# EasyEDA schematic SCH_WEARBLE HEALTH MONITER_2024-07-04.json
TITLE: Sheet_1; REV: 1.0; Date: 2024-07-02; Sheet: 1/1; Company: Your Company
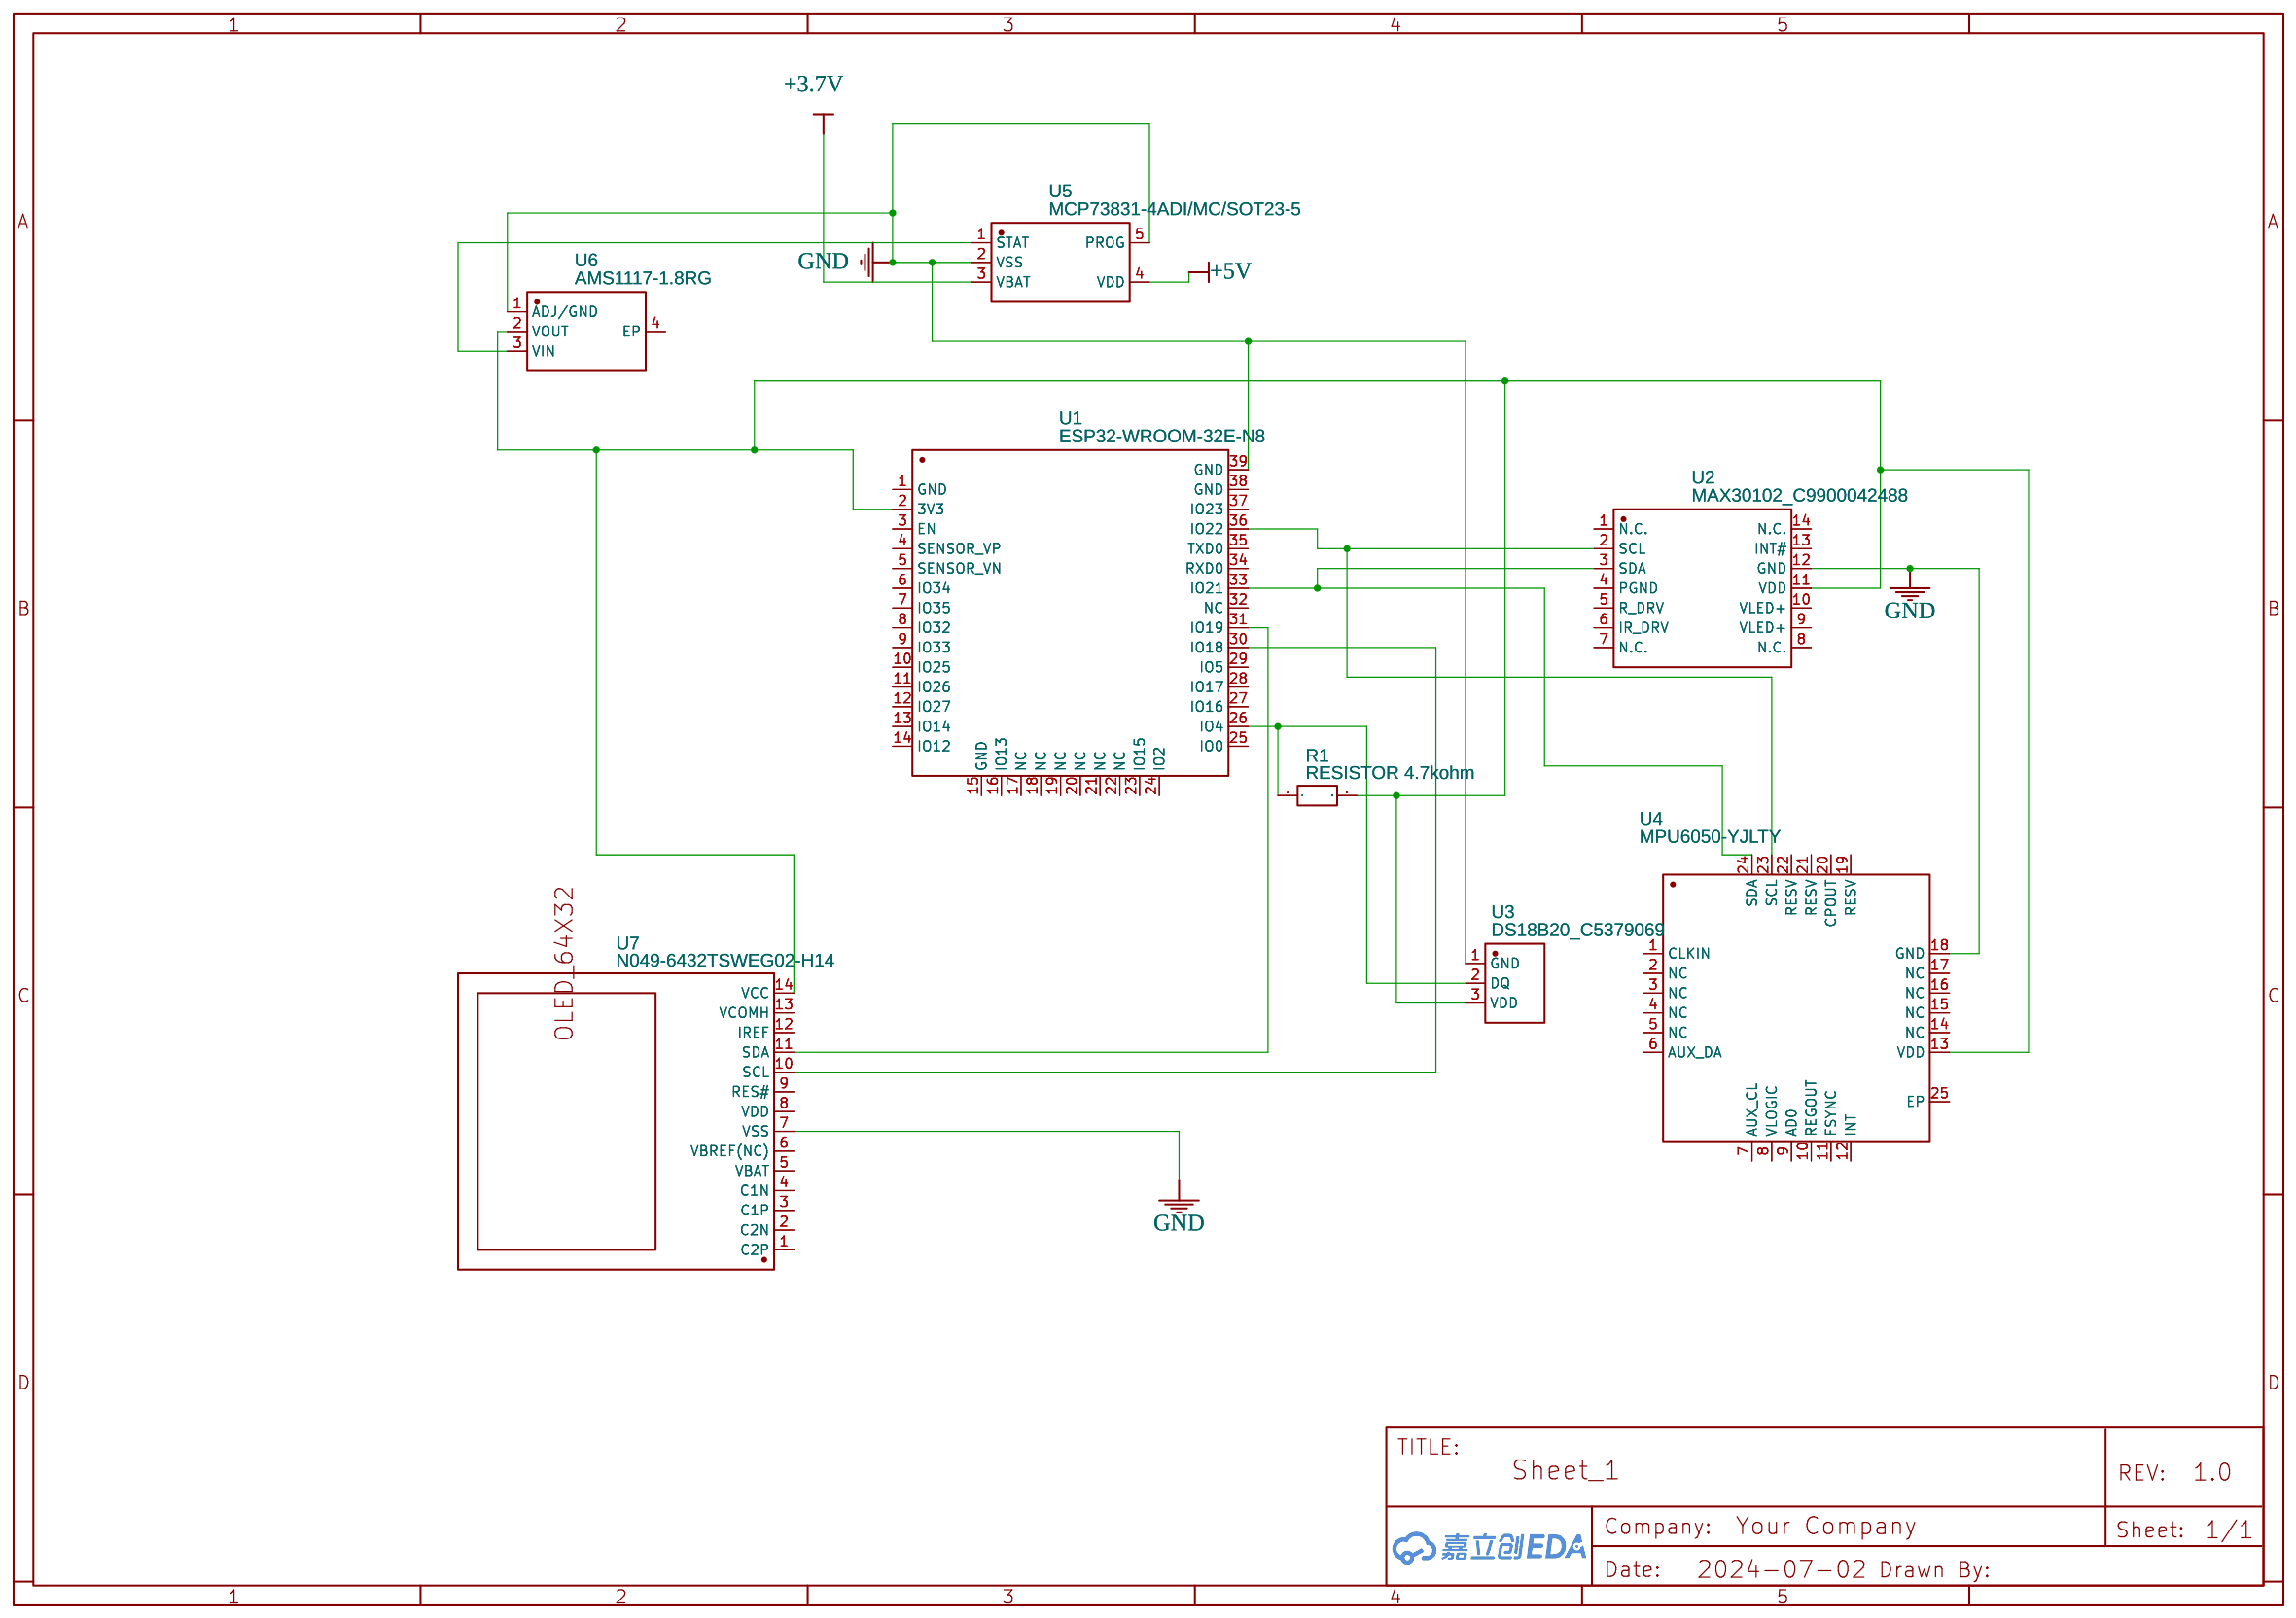
[diagram p0: schematic sheet]

## Parts
R1  RESISTOR 4.7kohm  [RES-TH_12R_2W]
U1  ESP32-WROOM-32E-N8  [WIFI-SMD_ESP32-WROOM-32E]
U2  MAX30102_C9900042488  [OESIP-14_L5.6-W3.3-P0.80-TL]
U3  DS18B20_C5379069  [TO-92-3_L4.9-W3.7-P1.27-L]
U4  MPU6050-YJLTY  [QFN-24_L4.0-W4.0-P0.50-BL-EP2.7]
U5  MCP73831-4ADI/MC/SOT23-5  [SOT-23-5_L2.9-W1.6-P0.95-LS2.8-BR]
U6  AMS1117-1.8RG  [SOT-223-3_L6.7-W3.7-P2.30-LS7.0-BR]
U7  N049-6432TSWEG02-H14  [OLED-SMD_N049-6432TSWEG02-H14]

## Library data of the parts
R1 = RESISTOR_THT:R_AXIAL_DIN0309_L9.0MM_D3.2MM_P2.54MM_VERTICAL: Contributor: lcsc; Supplier: LCSC; Supplier Part: C9900016274; Manufacturer: null; JLCPCB Part Class: Extended Part
U1 = ESP32-WROOM-32E-N8: Contributor: lcsc; Supplier: LCSC; Supplier Part: C2973651; Manufacturer: null; JLCPCB Part Class: Extended Part
U2 = MAX30102_C9900042488: Contributor: lcsc; Supplier: LCSC; Supplier Part: C9900042488; Manufacturer: null
U3 = DS18B20_C5379069: Contributor: lcsc; Supplier: LCSC; Supplier Part: C5379069; Manufacturer: MSKSEMI(美森科); JLCPCB Part Class: Extended Part
U4 = MPU6050-YJLTY: Contributor: LCSC; Supplier: LCSC; Supplier Part: C2912107; Manufacturer: null; JLCPCB Part Class: Extended Part
U5 = MCP73831-4ADI/MC/SOT23-5: Contributor: lcsc; Supplier: LCSC; Supplier Part: C9900033411; Manufacturer: null; JLCPCB Part Class: Extended Part
U6 = AMS1117-1.8RG: Contributor: lcsc; Supplier: LCSC; Supplier Part: C2977153; Manufacturer: HGC(深圳汉芯)
U7 = N049-6432TSWEG02-H14: Supplier: LCSC; Supplier Part: C2890603; Manufacturer: Newvision(新智景); Contributor: lcsc

## Nets
+3.7V: U5.3(VBAT)
+5V: U5.4(VDD)
GND: U1.39(GND) U2.12(GND) U3.1(GND) U4.18(GND) U5.2(VSS) U5.5(PROG) U6.1(ADJ/GND) U7.7(VSS)
Net-(R1-1): R1.1 U1.26(IO4) U3.2(DQ)
Net-(R1-2): R1.2 U1.2(3V3) U2.11(VDD) U3.3(VDD) U4.13(VDD) U6.2(VOUT) U7.14(VCC)
Net-(U1-30): U1.30(IO18) U7.10(SCL)
Net-(U1-31): U1.31(IO19) U7.11(SDA)
Net-(U1-33): U1.33(IO21) U2.3(SDA) U4.24(SDA)
Net-(U1-36): U1.36(IO22) U2.2(SCL) U4.23(SCL)
Net-(U5-1): U5.1(STAT) U6.3(VIN)

Not connected (* = marked no-connect by the designer): U1 1(GND) 3(EN) 4(SENSOR_VP) 5(SENSOR_VN) 6(IO34) 7(IO35) 8(IO32) 9(IO33) 10(IO25) 11(IO26) 12(IO27) 13(IO14) 14(IO12) 15(GND) 16(IO13) 17(NC) 18(NC) 19(NC) 20(NC) 21(NC) 22(NC) 23(IO15) 24(IO2) 25(IO0) 27(IO16) 28(IO17) 29(IO5) 32(NC) 34(RXD0) 35(TXD0) 37(IO23) 38(GND); U2 1(N.C.) 4(PGND) 5(R_DRV) 6(IR_DRV) 7(N.C.) 8(N.C.) 9(VLED+) 10(VLED+) 13(INT#) 14(N.C.); U4 1(CLKIN) 2(NC) 3(NC) 4(NC) 5(NC) 6(AUX_DA) 7(AUX_CL) 8(VLOGIC) 9(AD0) 10(REGOUT) 11(FSYNC) 12(INT) 14(NC) 15(NC) 16(NC) 17(NC) 19(RESV) 20(CPOUT) 21(RESV) 22(RESV) 25(EP); U6 4(EP); U7 1(C2P) 2(C2N) 3(C1P) 4(C1N) 5(VBAT) 6(VBREF(NC)) 8(VDD) 9(RES#) 12(IREF) 13(VCOMH)
